# Altium schematic sheet 1_AC-DC&PFC_Driver.schdoc
size 297 x 209 mm; Symbol: sucaimuban; Company: 嘉立创EDA; Version: V1.0; Page Size: A4; @Project Name: 26gsSucaiku; @Update Date: 2026-06-27; @Create Date: 2026-06-21; Device: sucaimuban; @Board Name: Sucaiku; @Page Name: AC-DC&PFC_Driver; @Create Time: 21:33:02; @Page Count: 7; @Page No: 1; @Schematic Name: Schematic1; @Update Time: 20:35:27; @Assembly Variant: Basic; Border: 1; Title Block Position: 3; Size: A4; Width: 1170; Height: 825; Region Start: 1; X Region Count: 6; Y Region Count: 4; Blade Width: 10
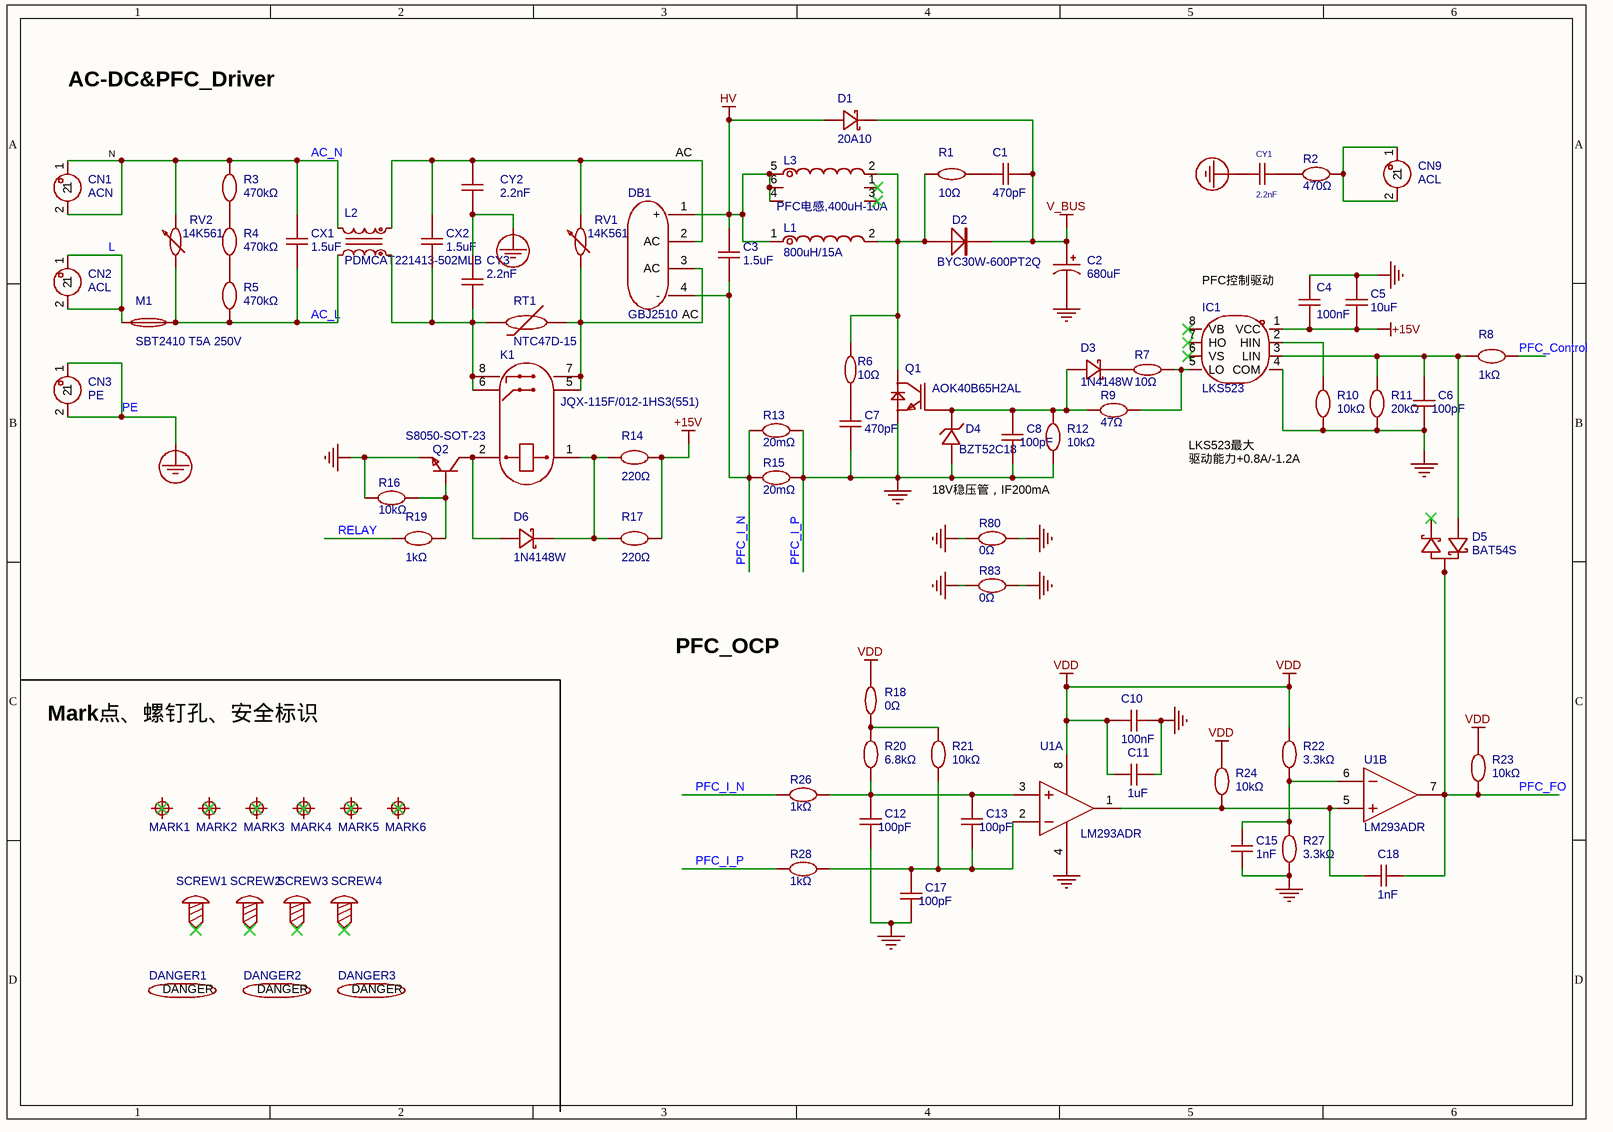
[diagram p0: 1_AC-DC&PFC_Driver.schdoc]

## Parts
C1  470pF  [CAP-TH_L10.0-W4.0-P7.50-D0.6]
C2  680uF  [CAP-TH_BD35.0-P10.00-D2.3-FD]
C3  1.5uF  [CBB 20*16*8.5]
C4  100nF  [C0603]
C5  10uF  [C0805]
C6  100pF  [C0603]
C7  470pF  [CAP-TH_L10.0-W4.0-P7.50-D0.6]
C8  100pF  [C0603]
C10  100nF  [C0603]
C11  1uF  [C0603]
C12  100pF  [C0603]
C13  100pF  [C0603]
C15  1nF  [C0603]
C17  100pF  [C0603]
C18  1nF  [C0603]
CN1  ACN  [CONN-TH_L6.3-W0.8-EST026]
CN2  ACL  [CONN-TH_L6.3-W0.8-EST026]
CN3  PE  [CONN-TH_L6.3-W0.8-EST026]
CN9  ACL  [CONN-TH_L6.3-W0.8-EST026]
CX1  1.5uF  [CAP-TH_L18.0-W11.0-P15.00-D0.8]
CX2  1.5uF  [CAP-TH_L18.0-W11.0-P15.00-D0.8]
CY1  2.2nF  [CAP-TH_L7.0-W3.5-P7.50-D0.6-S2.90]
CY2  2.2nF  [CAP-TH_L6.5-W3.5-P7.50-D1.0]
CY3  2.2nF  [CAP-TH_L6.5-W3.5-P7.50-D1.0]
D1  20A10  [R-6_BD8.9-L8.9-P12.90-D1.3-FD]
D2  BYC30W-600PT2Q  [TO247B - 2pin]
D3  1N4148W  [SOD-123_L2.7-W1.6-LS3.7-FD]
D4  BZT52C18  [SOD-123_L2.8-W1.8-LS3.7-RD]
D5  BAT54S  [SOT-23-3_L2.9-W1.3-P1.90-LS2.4-BR]
D6  1N4148W  [SOD-123_L2.7-W1.6-LS3.7-FD]
DANGER1  (no value)  [DANGER CAUTION_1]
DANGER2  (no value)  [DANGER CAUTION_1]
DANGER3  (no value)  [DANGER CAUTION_1]
DB1  GBJ2510  [DIO-BG-TH_PB]
IC1  LKS523  [SOP-8_L4.9-W3.9-P1.27-LS6.0-BL]
K1  JQX-115F/012-1HS3(551)  [RELAY-TH_JQX-115F-XXX-1H-X-3]
L1  800uH/15A  [L/56*30-V-50*30(25mm)]
L2  PDMCAT221413-502MLB  [IND-TH_4P-L28.0-W18.5_C2924777]
L3  PFC电感,400uH-10A  [L/50*36-V-21*11(7.5)]
M1  SBT2410 T5A 250V  [FUSE-SMD_L6.0-W2.6]
MARK1  (no value)  [Mark-Point-1mm]
MARK2  (no value)  [Mark-Point-1mm]
MARK3  (no value)  [Mark-Point-1mm]
MARK4  (no value)  [Mark-Point-1mm]
MARK5  (no value)  [Mark-Point-1mm]
MARK6  (no value)  [Mark-Point-1mm]
Q1  AOK40B65H2AL  [TO-247-3_L15.8-W5.0-P5.44-L]
Q2  S8050-SOT-23  [SOT-23-3_L2.9-W1.3-P1.90-LS2.5-BR]
R1  10Ω  [R2512]
R2  470Ω  [RES-TH_BD5.6-L10.3-P14.30-D1.0]
R3  470kΩ  [R1206]
R4  470kΩ  [R1206]
R5  470kΩ  [R1206]
R6  10Ω  [R2512]
R7  10Ω  [R0805]
R8  1kΩ  [R0603]
R9  47Ω  [R1206]
R10  10kΩ  [R0603]
R11  20kΩ  [R0603]
R12  10kΩ  [R0603]
R13  20mΩ  [RES-SMD_L6.4-W3.2_LR2512D-3W-1MR]
R14  220Ω  [R1206]
R15  20mΩ  [RES-SMD_L6.4-W3.2_LR2512D-3W-1MR]
R16  10kΩ  [R0603]
R17  220Ω  [R1206]
R18  0Ω  [R0603]
R19  1kΩ  [R0603]
R20  6.8kΩ  [R0603]
R21  10kΩ  [R0603]
R22  3.3kΩ  [R0603]
R23  10kΩ  [R0603]
R24  10kΩ  [R0603]
R26  1kΩ  [R0603]
R27  3.3kΩ  [R0603]
R28  1kΩ  [R0603]
R80  0Ω  [R1206]
R83  0Ω  [R1206]
RT1  NTC47D-15  [NTC-7.5-11]
RV1  14K561  [RES-TH_L16.5-W6.4-P7.50-D0.9-S6.40]
RV2  14K561  [RES-TH_L16.5-W6.4-P7.50-D0.9-S6.40]
SCREW1  (no value)  [M3螺丝]
SCREW2  (no value)  [M3螺丝]
SCREW3  (no value)  [M3螺丝]
SCREW4  (no value)  [M3螺丝]
U1  LM293ADR  [SOIC-8_L4.9-W3.9-P1.27-LS6.2-BL]  (parts A,B of 2)

## Nets
+15V: C4.1 C5.1 IC1.1(VCC) R14.2 R17.2
HV: C3.2 D1.1(A) DB1.1(+) L1.1 L3.4 L3.5 L3.6
PE: CN3.1 CN3.2 CY1.1 CY2.1 CY3.1
PFC_I_P: C2.2 C4.2 C5.2 C6.1 C7.1 C8.1 C10.1 C11.2 C12.1 C15.1 C17.1 D4.2(A) IC1.4(COM) Q1.3(E) Q2.2(E) R10.1 R11.1 R12.1 R13.2 R15.2 R16.2 R27.1 R28.2 R80.1 R80.2 R83.1 R83.2 U1.4(V+)  [also labelled GND]
V_BUS: C1.2 C2.1 D1.2(K) D2.1(K)
VDD: C10.2 C11.1 R18.2 R22.2 R23.2 R24.2 U1.8(GND)
AC_L: CX1.1 L2.2 M1.2 R5.1 RV2.1
AC_N: CN1.1 CN1.2 CX1.2 L2.3 R3.2 RV2.2
L: CN2.1 CN2.2 M1.1
PFC_Control: R8.2
PFC_FO: C18.2 D5.3 R23.1 U1.7(OUT2)
PFC_I_N: C3.1 DB1.4(-) R13.1 R15.1 R26.2
RELAY: R19.1
NetC1_1: C1.1 R1.2
NetC6_2: C6.2 D5.1(A) IC1.3(LIN) R8.1 R11.2
NetC7_2: C7.2 R6.1
NetC8_2: C8.2 D3.1(A) D4.1(C) Q1.1(G) R9.1 R12.2
NetC12_2: C12.2 C13.2 R20.1 R26.1 U1.3(IN1+)
NetC13_1: C13.1 C17.2 R21.1 R28.1 U1.2(IN1-)
NetC15_2: C15.2 R22.1 R27.2 U1.6(IN2-)
NetC18_1: C18.1 R24.1 U1.1(OUT1) U1.5(IN2+)
NetCN9_1: CN9.1 CN9.2 R2.2
NetCX2_1: CX2.1 CY3.2 K1.6 K1.8 L2.1 RT1.1
NetCX2_2: CX2.2 CY2.2 DB1.2(AC) L2.4 RV1.2
NetCY1_2: CY1.2 R2.1
NetD2_2: D2.2(A) L1.2 L3.2 Q1.2(C) R1.1 R6.2
NetD3_2: D3.2(K) R7.1
NetD6_1: D6.1(A) K1.2 Q2.3(C)
NetD6_2: D6.2(K) K1.1 R14.1 R17.1
NetDB1_3: DB1.3(AC) K1.5 K1.7 RT1.2 RV1.1
NetIC1_2: IC1.2(HIN) R10.2
NetIC1_5: IC1.5(LO) R7.2 R9.2
NetQ2_1: Q2.1(B) R16.1 R19.2
NetR3_1: R3.1 R4.2
NetR4_1: R4.1 R5.2
NetR18_1: R18.1 R20.2 R21.2

Not connected (* = marked no-connect by the designer): D5 2(K)*; IC1 6(VS)* 7(HO)* 8(VB)*; L3 1(6)* 3*; MARK1 1*; MARK2 1*; MARK3 1*; MARK4 1*; MARK5 1*; MARK6 1*; SCREW1 1*; SCREW2 1*; SCREW3 1*; SCREW4 1*

## Notes on the sheet
- AC-DC&PFC_Driver
- (near CN1) N
- AC
- (near DB1) AC
- (near IC1) PFC控制驱动
- 18V稳压管，IF200mA
- (near R10) LKS523最大
  驱动能力+0.8A/-1.2A
- PFC_OCP
- Mark点、螺钉孔、安全标识
- 身份证号
- 选手姓名
- 手 机 号
- 图页名称
- 第                      幅
- 工程名称
- 共                    幅
- 当前日期
- 当前时间

## Library data of the parts
C1 = MMKP471K3A0701: 容值:470pF;精度:±10%;额定电压:1kV;工作温度:-40℃~+105℃;; Manufacturer: KYET(科雅); AddInBom: yes; ModelId: 99f403e9d14b42e0ad59132bb97445e0聨0819f05c4eef4c71ace90d822a990e87; ModelName: CAP-TH_BD10.0-W4.0-P7.5; ModelTransform: 392.81,165.20329,0,0,0,0,0,0,-137.795; Tolerance: ±10%; Voltage Rating: 1kV; Symbol: MMKP471K3A0701; Device: MMKP471K3A0701; LCSC Part Name: 470pF ±10% 1kV; SupplierPart: C3019027; ManufacturerPart: MMKP471K3A0701; Supplier Footprint: 插件,P=7.5mm; JLCPCB Part Class: Extended Part; Datasheet: https://item.szlcsc.com/datasheet/MMKP471K3A0701/3533992.html; Supplier: LCSC; ConvertToPcb: yes; FootprintName: CAP-TH_L10.0-W4.0-P7.50-D0.6; Value: 470pF; Operating Temperature: -40℃~+105℃
C2 = KN681M45035*50A: 容值:680uF;精度:±20%;额定电压:450V;脚间距:10mm;等效串联电阻(ESR):-;纹波电流:2.85A@120Hz;; Manufacturer: KFSON(康富松); AddInBom: yes; ModelId: 99655738f73e4d50bff5807320ca27b0聨0819f05c4eef4c71ace90d822a990e87; ModelTransform: 1378.344,1377.53398,0,0,0,0,0,0,-157.48; Tolerance: ±20%; Voltage Rating: 450V; Pin Spacing: 10mm; Lifetime: 2000hrs@105℃; Symbol: KN681M45035*50A; Device: KN681M45035*50A; LCSC Part Name: 680uF ±20% 450V; SupplierPart: C2684457; ManufacturerPart: KN681M45035*50A; Supplier Footprint: 插件,D35xL50mm; JLCPCB Part Class: Extended Part; Datasheet: https://item.szlcsc.com/datasheet/KN681M45035*50A/2782461.html; Supplier: LCSC; ConvertToPcb: yes; FootprintName: CAP-TH_BD35.0-P10.00-D2.3-FD; ModelName: CAP-TH_BD35.0-P10.00-D2.3-FD; Value: 680uF; Equivalent Series Resistance(ESR): -; Ripple Current: 2.85A@120Hz; Diameter: 35mm; Height - Seated (Max): 50mm; Operating Temperature: -25℃~+105℃
C3 = KP155J2J2001: 容值:1.5uF;精度:±5%;额定电压:630V;工作温度:-40℃~+100℃;; Manufacturer: KYET(科雅); AddInBom: yes; ModelId: 8da85e7d984543eb9369ef1ce3ef33f5聨0819f05c4eef4c71ace90d822a990e87; ModelName: CAP-TH_L22.0-W11.0-P20.00-D0.7; ModelTransform: 866.14,433.464,0,0,0,0,0,0,-177.165; Tolerance: ±5%; Voltage Rating: 630V; Symbol: KP155J2J2001; Device: KP155J2J2001; LCSC Part Name: 1.5uF ±5% 630V; SupplierPart: C3019082; ManufacturerPart: KP155J2J2001; Supplier Footprint: 插件,P=20mm; JLCPCB Part Class: Extended Part; Datasheet: https://item.szlcsc.com/datasheet/KP155J2J2001/3534047.html; Supplier: LCSC; ConvertToPcb: yes; FootprintName: CBB 20*16*8.5; Value: 1.5uF; Operating Temperature: -40℃~+100℃
C4 C10 = CL10B104KB8NNNC: 容值:100nF;精度:±10%;额定电压:50V;温度系数:X7R;; Manufacturer: SAMSUNG(三星); AddInBom: yes; ModelId: ac125912035d415993ca9572d50418b1聨0819f05c4eef4c71ace90d822a990e87; ModelName: C0603_L1.6-W0.8-H0.8; ModelTransform: 62.992,31.496,0,0,0,0,0,0,0; Tolerance: ±10%; Voltage Rating: 50V; Temperature Coefficient: X7R; Symbol: CL10B104KB8NNNC; Device: CL10B104KB8NNNC; LCSC Part Name: 100nF ±10% 50V; SupplierPart: C1591; ManufacturerPart: CL10B104KB8NNNC; Supplier Footprint: 0603; JLCPCB Part Class: Extended Part; Datasheet: https://item.szlcsc.com/datasheet/CL10B104KB8NNNC/1943.html; Supplier: LCSC; ConvertToPcb: yes; FootprintName: C0603; Value: 100nF
C5 = CL21A106KAYNNNE_C15850: 容值:10uF;精度:±10%;额定电压:25V;温度系数:X5R;; Manufacturer: SAMSUNG(三星); AddInBom: yes; ModelId: 1ba041120af144c991958decab20d241聨0819f05c4eef4c71ace90d822a990e87; ModelName: C0805_L2.0-W1.3-H1.3; ModelTransform: 78.74,51.181,0,0,0,0,0,0.0005,0; Tolerance: ±10%; Voltage Rating: 25V; Temperature Coefficient: X5R; Symbol: CL21A106KAYNNNE; Device: CL21A106KAYNNNE_C15850; LCSC Part Name: 10uF ±10% 25V; SupplierPart: C15850; ManufacturerPart: CL21A106KAYNNNE; Supplier Footprint: 0805; JLCPCB Part Class: Basic Part; Datasheet: https://item.szlcsc.com/datasheet/CL21A106KAYNNNE/16532.html; Supplier: LCSC; ConvertToPcb: yes; FootprintName: C0805; Value: 10uF
C6 C8 C12 C13 C17 = CC0603JRNPO9BN101: 容值:100pF;精度:±5%;额定电压:50V;温度系数:NP0;; Manufacturer: YAGEO(国巨); AddInBom: yes; ModelId: ac125912035d415993ca9572d50418b1聨0819f05c4eef4c71ace90d822a990e87; ModelName: C0603_L1.6-W0.8-H0.8; ModelTransform: 62.992,31.496,0,0,0,0,0,0,0; Tolerance: ±5%; Voltage Rating: 50V; Temperature Coefficient: NP0; Symbol: CC0603JRNPO9BN101; Device: CC0603JRNPO9BN101; LCSC Part Name: 100pF ±5% 50V; SupplierPart: C14665; ManufacturerPart: CC0603JRNPO9BN101; Supplier Footprint: 0603; JLCPCB Part Class: Extended Part; Datasheet: https://item.szlcsc.com/datasheet/CC0603JRNPO9BN101/15333.html; Supplier: LCSC; ConvertToPcb: yes; FootprintName: C0603; Value: 100pF
C7 = MMKP471K3A0701: 容值:470pF;精度:±10%;额定电压:1kV;工作温度:-40℃~+105℃;; Manufacturer: KYET(科雅); 3D Model: 99f403e9d14b42e0ad59132bb97445e0聨0819f05c4eef4c71ace90d822a990e87; 3D Model Transform: 392.81,165.20329,0,0,0,0,0,0,-137.795; Tolerance: ±10%; Voltage Rating: 1kV; AddInBom: yes; ModelName: CAP-TH_BD10.0-W4.0-P7.5; Symbol: MMKP471K3A0701; Device: MMKP471K3A0701; LCSC Part Name: 470pF ±10% 1kV; Supplier Part: C3019027; Manufacturer Part: MMKP471K3A0701; Supplier Footprint: 插件,P=7.5mm; JLCPCB Part Class: Extended Part; Datasheet: https://item.szlcsc.com/datasheet/MMKP471K3A0701/3533992.html; Supplier: LCSC; Value: 470pF; Operating Temperature: -40℃~+105℃; ConvertToPcb: yes; FootprintName: CAP-TH_L10.0-W4.0-P7.50-D0.6
C11 = CL10B105KA8NNNC: 容值:1uF;精度:±10%;额定电压:25V;温度系数:X7R;; Manufacturer: SAMSUNG(三星); AddInBom: yes; ModelId: ac125912035d415993ca9572d50418b1聨0819f05c4eef4c71ace90d822a990e87; ModelName: C0603_L1.6-W0.8-H0.8; ModelTransform: 62.992,31.496,0,0,0,0,0,0,0; Tolerance: ±10%; Voltage Rating: 25V; Temperature Coefficient: X7R; Symbol: CL10B105KA8NNNC; Device: CL10B105KA8NNNC; LCSC Part Name: 1uF ±10% 25V; SupplierPart: C29936; ManufacturerPart: CL10B105KA8NNNC; Supplier Footprint: 0603; JLCPCB Part Class: Extended Part; Datasheet: https://item.szlcsc.com/datasheet/CL10B105KA8NNNC/30690.html; Supplier: LCSC; ConvertToPcb: yes; FootprintName: C0603; Value: 1uF
C15 C18 = CL10B102KB8NNNC: 容值:1nF;精度:±10%;额定电压:50V;温度系数:X7R;; Manufacturer: SAMSUNG(三星); AddInBom: yes; ModelId: ac125912035d415993ca9572d50418b1聨0819f05c4eef4c71ace90d822a990e87; ModelName: C0603_L1.6-W0.8-H0.8; ModelTransform: 62.992,31.496,0,0,0,0,0,0,0; Tolerance: ±10%; Voltage Rating: 50V; Temperature Coefficient: X7R; Symbol: CL10B102KB8NNNC; Device: CL10B102KB8NNNC; LCSC Part Name: 1nF ±10% 50V; SupplierPart: C1588; ManufacturerPart: CL10B102KB8NNNC; Supplier Footprint: 0603; JLCPCB Part Class: Basic Part; Datasheet: https://item.szlcsc.com/datasheet/CL10B102KB8NNNC/1940.html; Supplier: LCSC; ConvertToPcb: yes; FootprintName: C0603; Value: 1nF
CN1-CN3 = EST026: 环保; Manufacturer: xcfuse(旭程); AddInBom: yes; ModelId: caeb915258b34f389ee2048176497ca2聨0819f05c4eef4c71ace90d822a990e87; ModelTransform: 328.7395,78.74,0,0,0,0,0,0,-137.795; Symbol: EST026; Device: EST026; LCSC Part Name: EST026; SupplierPart: C52878; Supplier Footprint: 插件; Datasheet: https://item.szlcsc.com/datasheet/EST026/53893.html; Supplier: LCSC; ConvertToPcb: yes; FootprintName: CONN-TH_L6.3-W0.8-EST026; ModelName: CONN-TH_L6.3-W0.8-EST026
  CN1: Manufacturer Part: ACN
  CN2: Manufacturer Part: ACL
  CN3: Manufacturer Part: PE
CN9 = EST026: 环保; Manufacturer: xcfuse(旭程); 3D Model: caeb915258b34f389ee2048176497ca2聨0819f05c4eef4c71ace90d822a990e87; 3D Model Transform: 328.7395,78.74,0,0,0,0,0,0,-137.795; AddInBom: yes; Symbol: EST026; Device: EST026; Manufacturer Part: ACL; LCSC Part Name: EST026; Supplier Part: C52878; Supplier Footprint: 插件; JLCPCB Part Class: Extended Part; Datasheet: https://item.szlcsc.com/datasheet/EST026/53893.html; Supplier: LCSC; ConvertToPcb: yes; FootprintName: CONN-TH_L6.3-W0.8-EST026; ModelName: CONN-TH_L6.3-W0.8-EST026
CX1 CX2 = MPX155K31D7KN15800: 容值:1.5uF;精度:±10%;工作电压(AC):275V；310V；305V;防护等级:X2;; Manufacturer: KNSCHA(科尼盛); AddInBom: yes; ModelId: 67037bbaf53542ae96805cc30c99990b聨0819f05c4eef4c71ace90d822a990e87; ModelName: CAP-TH_L18.0-W11.0-H19.0-P15.0; ModelTransform: 708.66,433.07,0,0,0,0,0,0,-137.795; Tolerance: ±10%; Ratings: X2; safety certification: UL；CUL；KC；ENEC；VDE；CQC; Symbol: MPX155K31D7KN15800; Device: MPX155K31D7KN15800; LCSC Part Name: 1.5uF ±10% 275V 305V 310V 等级:X2; SupplierPart: C504227; ManufacturerPart: MPX155K31D7KN15800; Supplier Footprint: 插件,P=15mm; JLCPCB Part Class: Extended Part; Datasheet: https://item.szlcsc.com/datasheet/MPX155K31D7KN15800/516886.html; Supplier: LCSC; ConvertToPcb: yes; FootprintName: CAP-TH_L18.0-W11.0-P15.00-D0.8; Value: 1.5uF; Voltage(AC): 275V；310V；305V; Operating Temperature: -40℃~+110℃
CY1 = JW222M300VACP7.5: 容值:2.2nF;精度:±20%;工作电压(AC):300V;防护等级:Y2;; Manufacturer: JURCC(捷威电子); AddInBom: yes; ModelId: 95618c792d4044faae105d193811dc66聨0819f05c4eef4c71ace90d822a990e87; ModelTransform: 334.645,137.795,0,0,0,0,-0.002,0,-196.85; Tolerance: ±20%; Voltage(AC): 300V; Ratings: Y2; safety certification: UL；ENEC；VDE；CQC; Symbol: JW222M300VACP7.5; Device: JW222M300VACP7.5; LCSC Part Name: 2.2nF ±20% 300V 等级:Y2; SupplierPart: C48997971; ManufacturerPart: JW222M300VACP7.5; Supplier Footprint: 插件,P=7.5mm; JLCPCB Part Class: Extended Part; Datasheet: https://item.szlcsc.com/datasheet/JW222M300VACP7.5/51342107.html; Supplier: LCSC; ConvertToPcb: yes; FootprintName: CAP-TH_L7.0-W3.5-P7.50-D0.6-S2.90; ModelName: CAP-TH_L7.0-W3.5-P7.50-D0.6-S2.90; Value: 2.2nF; Operating Temperature: -25℃~+125℃
CY2 CY3 = KJKF222M2FF7035A075E: 容值:2.2nF;精度:±20%;工作电压(AC):300V;防护等级:Y2;; Manufacturer: KNSCHA(科尼盛); AddInBom: yes; ModelId: a1695fc487ef4c5abbd7ddf84a04b120聨0819f05c4eef4c71ace90d822a990e87; ModelName: CAP-TH_BD6.5-W3.5-P7.5; ModelTransform: 321.76377,145.669,0,0,0,0,-0.005,0,-137.795; Tolerance: ±20%; Voltage(AC): 300V; Ratings: Y2; safety certification: UL；ENEC；VDE；CQC; Symbol: KJKF222M2FF7035A075E; Device: KJKF222M2FF7035A075E; LCSC Part Name: 等级:Y2 2200pF ±20% 300V; SupplierPart: C2803195; ManufacturerPart: KJKF222M2FF7035A075E; Supplier Footprint: 插件,P=7.5mm; JLCPCB Part Class: Extended Part; Datasheet: https://item.szlcsc.com/datasheet/KJKF222M2FF7035A075E/2945566.html; Supplier: LCSC; ConvertToPcb: yes; FootprintName: CAP-TH_L6.5-W3.5-P7.50-D1.0; Value: 2.2nF
D1 = 20A10: 二极管配置:1个独立式;正向压降(Vf):1.1V;直流反向耐压(Vr):1kV;整流电流:20A;; Manufacturer: XCH(旭昌辉); AddInBom: yes; ModelId: 44ca3a3bb809421495e4ca0e88ba9e22聨0819f05c4eef4c71ace90d822a990e87; ModelTransform: 559.054,348.4245,0,0,0,0,0,0,-196.85; Diode Configuration: 1个独立式; Voltage - Forward(Vf@If): 1.1V; Voltage - DC Reverse(Vr): 1kV; Current - Rectified: 20A; Reverse Leakage Current (Ir): 5uA; Non-Repetitive Peak Forward Surge Current: 500A; Operating Junction Temperature Range: -55℃~+150℃; Symbol: 20A10; Device: 20A10; LCSC Part Name: 1kV 20A; SupplierPart: C5280530; ManufacturerPart: 20A10; Supplier Footprint: R-6; JLCPCB Part Class: Extended Part; Datasheet: https://item.szlcsc.com/datasheet/20A10/6016569.html; Supplier: LCSC; ConvertToPcb: yes; FootprintName: R-6_BD8.9-L8.9-P12.90-D1.3-FD; ModelName: R-6_BD8.9-L8.9-P12.90-D1.3-FD
D2 = 二极管\BYC30W-600PT2Q: SAP: 254259000038; AddInBom: yes; Symbol: 二极管\BYC30W-600PT2Q; Device: 二极管\BYC30W-600PT2Q; FootprintName: TO247B - 2pin; OriginFootprint: TO247B - 2pin
D3 = 1N4148W_C7420318: 二极管配置:独立式;整流电流:150mA;直流反向耐压(Vr):100V;正向压降(Vf):1.25V@150mA;反向恢复时间(Trr):4ns;; Manufacturer: R+O(宏嘉诚); 3D Model: 5054d9b7be8b429dad093a54b517b4dd聨0819f05c4eef4c71ace90d822a990e87; 3D Model Transform: 145.669,61.024,0,0,0,0,0,0,0; Diode Configuration: 独立式; Pd - Power Dissipation: 400mW; Current - Rectified: 150mA; Voltage - DC Reverse(Vr): 100V; Non-Repetitive Peak Forward Surge Current: 2A; Reverse Leakage Current (Ir): 1uA@75V; Reverse Recovery Time (trr): 4ns; Operating Junction Temperature Range: -55℃~+150℃; AddInBom: yes; Symbol: 1N4148W_C7420318; Device: 1N4148W_C7420318; LCSC Part Name: 100V 150mA; Supplier Part: C7420318; Manufacturer Part: 1N4148W; Supplier Footprint: SOD-123; JLCPCB Part Class: Extended Part; Datasheet: https://item.szlcsc.com/datasheet/1N4148W/8397140.html; Supplier: LCSC; Voltage - Forward(Vf@If): 1.25V@150mA; ConvertToPcb: yes; FootprintName: SOD-123_L2.7-W1.6-LS3.7-FD; ModelName: SOD-123_L2.7-W1.6-LS3.7-FD
D4 = BZT52C18_C43490: 二极管配置:1个独立式;稳压值(标称值):18V;稳压值(范围):16.8V~19.1V;耗散功率(Pd):500mW;; Manufacturer: CJ(江苏长电/长晶); AddInBom: yes; ModelId: 7884390a25fb4c08947731ebfba7e3f8聨0819f05c4eef4c71ace90d822a990e87; ModelTransform: 144.8816,62.992,0,0,0,0,0,0,0; Diode Configuration: 1个独立式; Zener Voltage(Nom): 18V; Reverse Leakage Current (Ir): 100nA@12.6V; Pd - Power Dissipation: 500mW; Impedance(Zzt): 45Ω; Impedance(Zzk): 225Ω; Operating Junction Temperature Range: -55℃~+150℃; Symbol: BZT52C18; Device: BZT52C18_C43490; LCSC Part Name: 独立式 耐压:18V 电流:0.1uA@12.6V; SupplierPart: C43490; ManufacturerPart: BZT52C18; Supplier Footprint: SOD-123; JLCPCB Part Class: Extended Part; Datasheet: https://item.szlcsc.com/datasheet/BZT52C18/44481.html; Supplier: LCSC; ConvertToPcb: yes; FootprintName: SOD-123_L2.8-W1.8-LS3.7-RD; ModelName: SOD-123_L2.8-W1.8-LS3.7-RD; Zener Voltage(Range): 16.8V~19.1V; Tolerance: -
D5 = BAT54S_C916425: 二极管配置:1对串联式;正向压降(Vf):800mV@100mA;直流反向耐压(Vr):30V;整流电流:200mA;; Manufacturer: JSMSEMI(杰盛微); AddInBom: yes; ModelId: c62791f0466c4ae2a892c056b845b0ca聨0819f05c4eef4c71ace90d822a990e87; ModelName: SOT-23-3P_L2.9-W1.3-H1.0-LS2.4-P0.95; ModelTransform: 98.425,114.173,0,180,0,0,0.0005,-0.0005,0; Diode Configuration: 1对串联式; Voltage - DC Reverse(Vr): 30V; Current - Rectified: 200mA; Reverse Leakage Current (Ir): 2uA@25V; Non-Repetitive Peak Forward Surge Current: 600mA; Symbol: BAT54S_C916425; Device: BAT54S_C916425; LCSC Part Name: 电压:30V 电流:200mA; SupplierPart: C916425; ManufacturerPart: BAT54S; Supplier Footprint: SOT-23; JLCPCB Part Class: Extended Part; Datasheet: https://item.szlcsc.com/datasheet/BAT54S/990921.html; Supplier: LCSC; ConvertToPcb: yes; FootprintName: SOT-23-3_L2.9-W1.3-P1.90-LS2.4-BR; Voltage - Forward(Vf@If): 800mV@100mA
D6 = 1N4148W_C7420318: 二极管配置:独立式;整流电流:150mA;直流反向耐压(Vr):100V;正向压降(Vf):1.25V@150mA;反向恢复时间(Trr):4ns;; Manufacturer: R+O(宏嘉诚); AddInBom: yes; ModelId: 5054d9b7be8b429dad093a54b517b4dd聨0819f05c4eef4c71ace90d822a990e87; ModelTransform: 145.669,61.024,0,0,0,0,0,0,0; Diode Configuration: 独立式; Pd - Power Dissipation: 400mW; Current - Rectified: 150mA; Voltage - DC Reverse(Vr): 100V; Non-Repetitive Peak Forward Surge Current: 2A; Reverse Leakage Current (Ir): 1uA@75V; Reverse Recovery Time (trr): 4ns; Operating Junction Temperature Range: -55℃~+150℃; Symbol: 1N4148W_C7420318; Device: 1N4148W_C7420318; LCSC Part Name: 100V 150mA; SupplierPart: C7420318; ManufacturerPart: 1N4148W; Supplier Footprint: SOD-123; JLCPCB Part Class: Extended Part; Datasheet: https://item.szlcsc.com/datasheet/1N4148W/8397140.html; Supplier: LCSC; ConvertToPcb: yes; FootprintName: SOD-123_L2.7-W1.6-LS3.7-FD; ModelName: SOD-123_L2.7-W1.6-LS3.7-FD; Voltage - Forward(Vf@If): 1.25V@150mA
DANGER1-DANGER3 = DANGER: AddInBom: yes; Symbol: DANGER; Device: DANGER; FootprintName: DANGER CAUTION_1; ConvertToPcb: yes
DB1 = GBJ2510_C27523: 正向压降(Vf):1V@12.5A;直流反向耐压 (Vr):1kV;整流电流:25A;非重复峰值浪涌电流 (Ifsm):350A;; Manufacturer: MDD(辰达半导体); AddInBom: yes; ModelId: 7b3dffbc1a98477fa7ce54e971affac0聨0819f05c4eef4c71ace90d822a990e87; ModelName: DIO-BG-TH_GBJ-L30.0-W4.6-H20.0; ModelTransform: 1181.1,181.102,0,0,0,0,0,23.622,-137.795; Voltage - DC Reverse(Vr): 1kV; Current - Rectified: 25A; Reverse Leakage Current (Ir): 10uA@1kV; Non-Repetitive Peak Forward Surge Current: 350A; Operating Junction Temperature Range: -55℃~+150℃@(Tj); Symbol: GBJ2510; Device: GBJ2510_C27523; LCSC Part Name: 耐压:1000V 电流:25A; SupplierPart: C27523; ManufacturerPart: GBJ2510; Supplier Footprint: GBJ6; JLCPCB Part Class: Extended Part; Datasheet: https://item.szlcsc.com/datasheet/GBJ2510/28272.html; Supplier: LCSC; ConvertToPcb: yes; FootprintName: DIO-BG-TH_PB; Voltage - Forward(Vf@If): 1V@12.5A; Type: 单相整流
IC1 = LKS523: 驱动配置:半桥;负载类型:MOSFET；IGBT;驱动通道数:2;灌电流(IOL):-;拉电流(IOH):-;工作电压:10V~20V;上升时间(tr):160ns;下降时间(tf):40ns;; Manufacturer: LINKOSEMI(凌鸥创芯); AddInBom: yes; ModelId: 75c24a7891ee4dd6bdac16a7163ff87e聨0819f05c4eef4c71ace90d822a990e87; ModelName: SOP-8_L4.9-W3.9-P1.27-LS6.0-BL-1; ModelTransform: 192.913,236.22,0,0,0,0,-0.393,2.749,0; Driven Configuration: 半桥; Number of Drivers: 2; Rise Time: 160ns; Fall Time: 40ns; Propagation Delay tpLH: 250ns; Input Logic Level - High: 2.4V~10V; Quiescent Current(Iq): 50uA; Symbol: LKS523; Device: LKS523; LCSC Part Name: 600V半桥预驱动器; SupplierPart: C6337451; ManufacturerPart: LKS523; Supplier Footprint: SOP-8; JLCPCB Part Class: Extended Part; Datasheet: https://item.szlcsc.com/datasheet/LKS523/7286042.html; Supplier: LCSC; ConvertToPcb: yes; FootprintName: SOP-8_L4.9-W3.9-P1.27-LS6.0-BL; Load Type: MOSFET；IGBT; Current - Output Low(IOL): -; Current - Output High(IOH): -; Voltage - Supply: 10V~20V; Propagation Delay tpHL: -; Features: 欠压保护(UVP); Operating Temperature: -40℃~+150℃; Input Logic Level - Low: -
K1 = JQX-115F/012-1HS3(551): 线圈电压:12V;触点形式:一组常开:1A(单刀单掷-常开);触点容量(电阻负载):16A@250VAC;最大切换电压:440V@AC；125V@DC;最大切换电流:16A;; Manufacturer: HF(宏发); AddInBom: yes; ModelId: 97babde272554f80b5cf5d364714ca22聨0819f05c4eef4c71ace90d822a990e87; ModelTransform: 499.999,1141.73,0,0,0,0,0,-3.937,-157.48; Coil Voltage: 12V; Coil Rated Power: 400mW; Switching Current(Max): 16A; Coil Type: 无极性-单线圈; Coil Resistance: 360Ω; Contact Resistance: 50mΩ; Operate Time: 15ms; Release Time: 8ms; Symbol: JQX-115F/012-1HS3(551); Device: JQX-115F/012-1HS3(551); LCSC Part Name: 12V继电器 单刀单掷-常开; SupplierPart: C2976884; ManufacturerPart: JQX-115F/012-1HS3(551); Supplier Footprint: DIP,29x12.7mm; JLCPCB Part Class: Extended Part; Datasheet: https://item.szlcsc.com/datasheet/JQX-115F%252F012-1HS3(551)/3385104.html; Supplier: LCSC; ConvertToPcb: yes; FootprintName: RELAY-TH_JQX-115F-XXX-1H-X-3; ModelName: RELAY-TH_JQX-115F-XXX-1H-X-3; Contact Form: 一组常开:1A(单刀单掷-常开); Number of Pins: 6; Contact Rating: 16A@250VAC; Switching Voltage(Max): 440V@AC；125V@DC; Contact Material: AgCdO; Operating Temperature: -40℃~+85℃; Length: 29mm; Width: 12.7mm
L1 = PFC电感,NPF184060,H56mm,800uH/15A,DIP: AddInBom: yes; Symbol: PFC电感,NPF184060,H56mm,800uH/15A,DIP; Device: PFC电感,NPF184060,H56mm,800uH/15A,DIP; FootprintName: L/56*30-V-50*30(25mm); OriginFootprint: L/56*30-V-50*30(25mm)
L2 = PDMCAT221413-502MLB: 通道数:2;电感@频率:5mH@1kHz;阻抗@频率:-;直流电阻(DCR):28mΩ;; Manufacturer: PROD(谱罗德); AddInBom: yes; ModelId: a35421b700c54666aff5300c8b8d11b3聨0819f05c4eef4c71ace90d822a990e87; ModelTransform: 1101.94449,728.345,0,0,0,0,0,0,-118.11; Number of Lines: 2; Current Rating: 9.5A; Voltage Rating - DC: 1.5kV; DC Resistance(DCR): 28mΩ; Symbol: PDMCAT221413-502MLB; Device: PDMCAT221413-502MLB; LCSC Part Name: 两路 插件共模滤波器; SupplierPart: C2924779; ManufacturerPart: PDMCAT221413-502MLB; Supplier Footprint: 插件-4P,28x18.5mm; JLCPCB Part Class: Extended Part; Datasheet: https://item.szlcsc.com/datasheet/PDMCAT221413-502MLB/3242508.html; Supplier: LCSC; ConvertToPcb: yes; FootprintName: IND-TH_4P-L28.0-W18.5_C2924777; ModelName: IND-TH_4P-L28.0-W18.5_C2924777; Inductance @ Frequency: 5mH@1kHz; Impedance @ Frequency: -; Voltage Rating (AC): 1.5kV; Voltage Withstand: 1.5kV; Operating Temperature: -25℃~+105℃; Insulation Resistance(IR): -
L3 = 400uH-10A L21 W11: AddInBom: yes; Symbol: 400uH-10A L21 W11; Device: 400uH-10A L21 W11; FootprintName: L/50*36-V-21*11(7.5); OriginFootprint: L/50*36-V-21*11(7.5); ConvertToPcb: yes
M1 = SBT2410 T5A 250V: Manufacturer: CHEVRON(诚润电子); AddInBom: yes; ModelId: f316ebb9f9ad4eff889fde0d73b65136聨0819f05c4eef4c71ace90d822a990e87; ModelTransform: 236.22,102.362,0,0,0,0,0,0,0; Symbol: SBT2410 T5A 250V; Device: SBT2410 T5A 250V; LCSC Part Name: 5A 250V; SupplierPart: C2839753; ManufacturerPart: SBT2410 T5A 250V; Supplier Footprint: SMD; JLCPCB Part Class: Extended Part; Datasheet: https://item.szlcsc.com/datasheet/SBT2410%2520T5A%2520250V/3017024.html; Supplier: LCSC; ConvertToPcb: yes; FootprintName: FUSE-SMD_L6.0-W2.6; ModelName: FUSE-SMD_L6.0-W2.6
MARK1-MARK6 = Mark-Point: Mark点; AddInBom: no; ConvertToPcb: yes; Symbol: Mark-Point; Device: Mark-Point; FootprintName: Mark-Point-1mm
Q1 = AOK40B65H2AL: IGBT类型:-;集射极击穿电压(Vces):650V;集电极电流(Ic):80A;耗散功率(Pd):-;; Manufacturer: AOS; AddInBom: yes; ModelId: 2dc33f6e48bd44aa838c2b9e2b85eb16聨0819f05c4eef4c71ace90d822a990e87; ModelTransform: 622.04631,185.078,0,0,0,0,-0.003,13.778,-196.85; Collector-Emitter Breakdown Voltage (Vces): 650V; Current - Collector(Ic): 80A; Voltage - Forward(Vf): 2.12V@20A; Vce Saturation(VCE(sat)): 2.6V@40A,15V; Gate-Emitter Threshold Voltage (Vge(th)@Ic): 4.7V@1mA; Gate Charge(Qg): 61nC; Input Capacitance(Cies): 1.23nF@25V; Td(on): 30ns; Td(off): 117ns; Turn-On Energy (Eon): 1.17mJ; Switching Energy(Eoff): 540uJ; Reverse Recovery Time(trr): 315ns; Symbol: AOK40B65H2AL; Device: AOK40B65H2AL; LCSC Part Name: AOK40B65H2AL; SupplierPart: C17588896; ManufacturerPart: AOK40B65H2AL; Supplier Footprint: TO-247; JLCPCB Part Class: Extended Part; Datasheet: https://item.szlcsc.com/datasheet/AOK40B65H2AL/18718129.html; Supplier: LCSC; ConvertToPcb: yes; FootprintName: TO-247-3_L15.8-W5.0-P5.44-L; ModelName: TO-247-3_L15.8-W5.0-P5.44-L; IGBT Type: -; Pd - Power Dissipation: -; Operating Temperature: -
Q2 = S8050-SOT-23: 晶体管类型：NPN。                 集电极电流ICM:0.5A                   集电极-基极击穿电压BVCBO:40V         集电极-发射极击穿电压BVCEO:25V       直流电流增益HFE:200-350                        丝印：J3Y; Manufacturer: DDF(鼎德丰); AddInBom: yes; ModelId: 6ea1b42e609b4c388d37f6ca14da8e20聨0819f05c4eef4c71ace90d822a990e87; ModelTransform: 114.173,98.425,0,90,0,0,0.001,-0.001,0; Symbol: S8050-SOT-23; Device: S8050-SOT-23; LCSC Part Name: S8050-SOT-23; SupplierPart: C50229533; ManufacturerPart: S8050-SOT-23; Supplier Footprint: SOT-23; JLCPCB Part Class: Extended Part; Datasheet: https://item.szlcsc.com/datasheet/S8050-SOT-23/52814686.html; Supplier: LCSC; ConvertToPcb: yes; FootprintName: SOT-23-3_L2.9-W1.3-P1.90-LS2.5-BR; ModelName: SOT-23-3_L2.9-W1.3-P1.90-LS2.5-BR
R1 = 25121WF100JT4E: 电阻类型:厚膜电阻;阻值:10Ω;精度:±1%;功率:1W;工作电压:200V;温度系数:±400ppm/℃;; Manufacturer: UNI-ROYAL(厚声); AddInBom: yes; ModelId: 954b67263d9e4f3582d8de3f8c846421聨0819f05c4eef4c71ace90d822a990e87; ModelName: R2512_L6.3-W3.2-H0.6; ModelTransform: 248.031,125.984,0,0,0,0,-0.0005,0,0; Tolerance: ±1%; Power(Watts): 1W; Voltage-Supply(Max): 200V; Symbol: 25121WF100JT4E; Device: 25121WF100JT4E; LCSC Part Name: 10Ω ±1% 1W 厚膜电阻; SupplierPart: C47019; ManufacturerPart: 25121WF100JT4E; Supplier Footprint: 2512; JLCPCB Part Class: Extended Part; Datasheet: https://item.szlcsc.com/datasheet/25121WF100JT4E/48024.html; Supplier: LCSC; ConvertToPcb: yes; FootprintName: R2512; Type: 厚膜电阻; Value: 10Ω; Temperature Coefficient: ±400ppm/℃; Operating Temperature: -55℃~+155℃
R2 = 42J470E: 电阻类型:绕线电阻;阻值:470Ω;精度:±5%;功率:2W;温度系数:±20ppm/℃;; Manufacturer: Ohmite; AddInBom: yes; ModelId: 4747cf4e98b642d29179640c6a2117b8聨0819f05c4eef4c71ace90d822a990e87; ModelTransform: 602.361,220.472,0,0,0,0,0,0,-196.85; Tolerance: ±5%; Power(Watts): 2W; Symbol: 42J470E; Device: 42J470E; LCSC Part Name: 绕线电阻 470Ω ±5% 2W; SupplierPart: C2647050; ManufacturerPart: 42J470E; Supplier Footprint: 插件,D5.6xL10.3mm; JLCPCB Part Class: Extended Part; Datasheet: https://atta.szlcsc.com/upload/public/pdf/source/20210415/FD57F7914712F3BEBDE1F10436F3A07C.pdf; Supplier: LCSC; ConvertToPcb: yes; FootprintName: RES-TH_BD5.6-L10.3-P14.30-D1.0; ModelName: RES-TH_BD5.6-L10.3-P14.30-D1.0; Type: 绕线电阻; Value: 470Ω; Temperature Coefficient: ±20ppm/℃; Operating Temperature Range: -
R3-R5 = FQV1206F4703TS: 电阻类型:厚膜电阻;阻值:470kΩ;精度:±1%;功率:250mW;工作电压:500V;温度系数:±200ppm/℃;; Manufacturer: FOJAN(富捷); AddInBom: yes; ModelId: 89a1f13db2384da588040e0b3c55bf66聨0819f05c4eef4c71ace90d822a990e87; ModelName: R1206_L3.2-W1.6-H0.6; ModelTransform: 125.984,62.992,0,0,0,0,0,0,0; Tolerance: ±1%; Power(Watts): 250mW; Voltage-Supply(Max): 500V; Symbol: FQV1206F4703TS; Device: FQV1206F4703TS; LCSC Part Name: 厚膜电阻 470KΩ ±1% 250mW; SupplierPart: C53064385; ManufacturerPart: FQV1206F4703TS; Supplier Footprint: 1206; JLCPCB Part Class: Extended Part; Datasheet: https://item.szlcsc.com/datasheet/FQV1206F4703TS/56018987.html; Supplier: LCSC; ConvertToPcb: yes; FootprintName: R1206; Type: 厚膜电阻; Value: 470kΩ; Temperature Coefficient: ±200ppm/℃; Operating Temperature: -55℃~+155℃
R6 = 25121WF100JT4E: 电阻类型:厚膜电阻;阻值:10Ω;精度:±1%;功率:1W;工作电压:200V;温度系数:±400ppm/℃;; Manufacturer: UNI-ROYAL(厚声); 3D Model: 954b67263d9e4f3582d8de3f8c846421聨0819f05c4eef4c71ace90d822a990e87; 3D Model Transform: 248.031,125.984,0,0,0,0,-0.0005,0,0; Tolerance: ±1%; Power(Watts): 1W; Voltage-Supply(Max): 200V; AddInBom: yes; ModelName: R2512_L6.3-W3.2-H0.6; Symbol: 25121WF100JT4E; Device: 25121WF100JT4E; LCSC Part Name: 10Ω ±1% 1W 厚膜电阻; Supplier Part: C47019; Manufacturer Part: 25121WF100JT4E; Supplier Footprint: 2512; JLCPCB Part Class: Extended Part; Datasheet: https://item.szlcsc.com/datasheet/25121WF100JT4E/48024.html; Supplier: LCSC; Type: 厚膜电阻; Value: 10Ω; Temperature Coefficient: ±400ppm/℃; Operating Temperature: -55℃~+155℃; ConvertToPcb: yes; FootprintName: R2512
R7 = RC0805JR-0710RL: 电阻类型:厚膜电阻;阻值:10Ω;精度:±5%;功率:125mW;工作电压:150V;温度系数:±200ppm/℃;; Manufacturer: YAGEO(国巨); AddInBom: yes; ModelId: 37a81e68749a4138bd2dfa6897b24b85聨0819f05c4eef4c71ace90d822a990e87; ModelName: R0805_L2.0-W1.3-H0.6; ModelTransform: 78.74,51.181,0,0,0,0,0,-0.0005,0; Tolerance: ±5%; Power(Watts): 125mW; Voltage-Supply(Max): 150V; Symbol: RC0805JR-0710RL; Device: RC0805JR-0710RL; LCSC Part Name: 厚膜电阻 10Ω ±5% 125mW; SupplierPart: C137478; ManufacturerPart: RC0805JR-0710RL; Supplier Footprint: 0805; JLCPCB Part Class: Extended Part; Datasheet: https://item.szlcsc.com/datasheet/RC0805JR-0710RL/148794.html; Supplier: LCSC; ConvertToPcb: yes; FootprintName: R0805; Type: 厚膜电阻; Value: 10Ω; Temperature Coefficient: ±200ppm/℃; Operating Temperature: -55℃~+155℃
R8 R26 R28 = AST031KF: 阻值:1kΩ;精度:±1%;功率:100mW;工作电压:75V;温度系数:±100ppm/℃;; Manufacturer: HKR(香港电阻); 3D Model: fc143cca1e79419f9cd78b61e9279f08聨0819f05c4eef4c71ace90d822a990e87; 3D Model Transform: 31.8897,63.7794,0,90,0,0,0,0,0; Tolerance: ±1%; Power(Watts): 100mW; Voltage-Supply(Max): 75V; AddInBom: yes; Symbol: AST031KF; Device: AST031KF; LCSC Part Name: 1K ±1%; Supplier Part: C49330120; Manufacturer Part: AST031KF; Supplier Footprint: 0603; JLCPCB Part Class: Extended Part; Datasheet: https://item.szlcsc.com/datasheet/AST031KF/51811762.html; Supplier: LCSC; Value: 1kΩ; Temperature Coefficient: ±100ppm/℃; Operating Temperature: -55℃~+155℃; ConvertToPcb: yes; FootprintName: R0603; ModelName: R0603
R9 = FRC1206J470 TS: 电阻类型:厚膜电阻;阻值:47Ω;精度:±5%;功率:250mW;工作电压:200V;温度系数:±100ppm/℃;; Manufacturer: FOJAN(富捷); AddInBom: yes; ModelId: 89a1f13db2384da588040e0b3c55bf66聨0819f05c4eef4c71ace90d822a990e87; ModelName: R1206_L3.2-W1.6-H0.6; ModelTransform: 125.984,62.992,0,0,0,0,0,0,0; Tolerance: ±5%; Power(Watts): 250mW; Voltage-Supply(Max): 200V; Symbol: FRC1206J470 TS; Device: FRC1206J470 TS; LCSC Part Name: 47Ω ±5% 250mW 厚膜电阻; SupplierPart: C2907508; ManufacturerPart: FRC1206J470 TS; Supplier Footprint: 1206; JLCPCB Part Class: Extended Part; Supplier: LCSC; ConvertToPcb: yes; FootprintName: R1206; Type: 厚膜电阻; Value: 47Ω; Temperature Coefficient: ±100ppm/℃; Operating Temperature: -55℃~+155℃
R10 R12 R16 R21 R23 R24 = AST0310KF: 阻值:10kΩ;精度:±1%;功率:100mW;工作电压:75V;温度系数:±100ppm/℃;; Manufacturer: HKR(香港电阻); 3D Model: fc143cca1e79419f9cd78b61e9279f08聨0819f05c4eef4c71ace90d822a990e87; 3D Model Transform: 31.8897,63.7794,0,90,0,0,0,0,0; Tolerance: ±1%; Power(Watts): 100mW; Voltage-Supply(Max): 75V; AddInBom: yes; Symbol: AST0310KF; Device: AST0310KF; LCSC Part Name: 10K ±1%; Supplier Part: C49330116; Manufacturer Part: AST0310KF; Supplier Footprint: 0603; JLCPCB Part Class: Extended Part; Datasheet: https://item.szlcsc.com/datasheet/AST0310KF/51811758.html; Supplier: LCSC; Value: 10kΩ; Temperature Coefficient: ±100ppm/℃; Operating Temperature: -55℃~+155℃; ConvertToPcb: yes; FootprintName: R0603; ModelName: R0603
R11 = AST0320KF: 阻值:20kΩ;精度:±1%;功率:100mW;工作电压:75V;温度系数:±100ppm/℃;; Manufacturer: HKR(香港电阻); AddInBom: yes; ModelId: fc143cca1e79419f9cd78b61e9279f08聨0819f05c4eef4c71ace90d822a990e87; ModelTransform: 31.8897,63.7794,0,90,0,0,0,0,0; Tolerance: ±1%; Power(Watts): 100mW; Voltage-Supply(Max): 75V; Symbol: AST0320KF; Device: AST0320KF; LCSC Part Name: 20K ±1%; SupplierPart: C49330123; ManufacturerPart: AST0320KF; Supplier Footprint: 0603; JLCPCB Part Class: Extended Part; Datasheet: https://item.szlcsc.com/datasheet/AST0320KF/51811765.html; Supplier: LCSC; ConvertToPcb: yes; FootprintName: R0603; ModelName: R0603; Value: 20kΩ; Temperature Coefficient: ±100ppm/℃; Operating Temperature: -55℃~+155℃
R13 R15 = HoYLR2512-3W-20mR-1%: 电阻类型:采样电阻;阻值:20mΩ;精度:±1%;功率:3W;安装方式:贴片;; Manufacturer: Milliohm(毫欧); AddInBom: yes; ModelId: 6cf6cbf2d5784533885afd09834c70e8聨0819f05c4eef4c71ace90d822a990e87; ModelTransform: 252.7554,126.7714,0,0,0,0,0,0,0; Tolerance: ±1%; Power(Watts): 3W; Mounting Sytle: 贴片; Symbol: HOYLR2512-3W-20MR-1%; Device: HoYLR2512-3W-20mR-1%; LCSC Part Name: 20mΩ ±1% 3W; SupplierPart: C5375467; ManufacturerPart: HoYLR2512-3W-20mR-1%; Supplier Footprint: 2512; JLCPCB Part Class: Extended Part; Datasheet: https://atta.szlcsc.com/upload/public/pdf/source/20230410/281FB57F2A31C64FD07DBC5FCC932F0E.pdf; Supplier: LCSC; ConvertToPcb: yes; FootprintName: RES-SMD_L6.4-W3.2_LR2512D-3W-1MR; ModelName: RES-SMD_L6.4-W3.2_LR2512D-3W-1MR; Type: 采样电阻; Value: 20mΩ
R14 R17 = AC1206JR-07220RL: 电阻类型:厚膜电阻;阻值:220Ω;精度:±5%;功率:250mW;工作电压:200V;温度系数:±100ppm/℃;; Manufacturer: YAGEO(国巨); AddInBom: yes; ModelId: 89a1f13db2384da588040e0b3c55bf66聨0819f05c4eef4c71ace90d822a990e87; ModelName: R1206_L3.2-W1.6-H0.6; ModelTransform: 125.984,62.992,0,0,0,0,0,0,0; Tolerance: ±5%; Power(Watts): 250mW; Voltage-Supply(Max): 200V; Symbol: AC1206JR-07220RL; Device: AC1206JR-07220RL; LCSC Part Name: 厚膜电阻 220Ω ±5% 250mW; SupplierPart: C229909; ManufacturerPart: AC1206JR-07220RL; Supplier Footprint: 1206; JLCPCB Part Class: Extended Part; Datasheet: https://item.szlcsc.com/datasheet/AC1206JR-07220RL/229889.html; Supplier: LCSC; ConvertToPcb: yes; FootprintName: R1206; Type: 厚膜电阻; Value: 220Ω; Temperature Coefficient: ±100ppm/℃; Operating Temperature: -55℃~+155℃
R18 = RC0603JR-070RL: 电阻类型:厚膜电阻;阻值:0Ω;精度:±5%;功率:100mW;工作电压:75V;温度系数:-;; Manufacturer: YAGEO(国巨); AddInBom: yes; ModelId: fc143cca1e79419f9cd78b61e9279f08聨0819f05c4eef4c71ace90d822a990e87; ModelTransform: 31.8897,63.7794,0,90,0,0,0,0,0; Tolerance: ±5%; Power(Watts): 100mW; Voltage-Supply(Max): 75V; Symbol: RC0603JR-070RL; Device: RC0603JR-070RL; LCSC Part Name: 厚膜电阻 0Ω ±5% 100mW; SupplierPart: C95177; ManufacturerPart: RC0603JR-070RL; Supplier Footprint: 0603; JLCPCB Part Class: Extended Part; Datasheet: https://item.szlcsc.com/datasheet/RC0603JR-070RL/96378.html; Supplier: LCSC; ConvertToPcb: yes; FootprintName: R0603; ModelName: R0603; Type: 厚膜电阻; Value: 0Ω; Temperature Coefficient: -; Operating Temperature: -55℃~+155℃
R19 = AST031KF: 阻值:1kΩ;精度:±1%;功率:100mW;工作电压:75V;温度系数:±100ppm/℃;; Manufacturer: HKR(香港电阻); AddInBom: yes; ModelId: fc143cca1e79419f9cd78b61e9279f08聨0819f05c4eef4c71ace90d822a990e87; ModelTransform: 31.8897,63.7794,0,90,0,0,0,0,0; Tolerance: ±1%; Power(Watts): 100mW; Voltage-Supply(Max): 75V; Symbol: AST031KF; Device: AST031KF; LCSC Part Name: 1K ±1%; SupplierPart: C49330120; ManufacturerPart: AST031KF; Supplier Footprint: 0603; JLCPCB Part Class: Extended Part; Datasheet: https://item.szlcsc.com/datasheet/AST031KF/51811762.html; Supplier: LCSC; ConvertToPcb: yes; FootprintName: R0603; ModelName: R0603; Value: 1kΩ; Temperature Coefficient: ±100ppm/℃; Operating Temperature: -55℃~+155℃
R20 = FRC0603F6801TS: 电阻类型:厚膜电阻;阻值:6.8kΩ;精度:±1%;功率:100mW;工作电压:75V;温度系数:±100ppm/℃;; Manufacturer: FOJAN(富捷); AddInBom: yes; ModelId: fc143cca1e79419f9cd78b61e9279f08聨0819f05c4eef4c71ace90d822a990e87; ModelTransform: 31.8897,63.7794,0,90,0,0,0,0,0; Tolerance: ±1%; Power(Watts): 100mW; Voltage-Supply(Max): 75V; Symbol: FRC0603F6801TS; Device: FRC0603F6801TS; LCSC Part Name: 6.8kΩ ±1% 100mW 厚膜电阻; SupplierPart: C2907055; ManufacturerPart: FRC0603F6801TS; Supplier Footprint: 0603; JLCPCB Part Class: Extended Part; Supplier: LCSC; ConvertToPcb: yes; FootprintName: R0603; ModelName: R0603; Type: 厚膜电阻; Value: 6.8kΩ; Temperature Coefficient: ±100ppm/℃; Operating Temperature: -55℃~+155℃
R22 R27 = FRC0603F3301TS: 电阻类型:厚膜电阻;阻值:3.3kΩ;精度:±1%;功率:100mW;工作电压:75V;温度系数:±100ppm/℃;; Manufacturer: FOJAN(富捷); AddInBom: yes; ModelId: fc143cca1e79419f9cd78b61e9279f08聨0819f05c4eef4c71ace90d822a990e87; ModelTransform: 31.8897,63.7794,0,90,0,0,0,0,0; Tolerance: ±1%; Power(Watts): 100mW; Voltage-Supply(Max): 75V; Symbol: FRC0603F3301TS; Device: FRC0603F3301TS; LCSC Part Name: 3.3kΩ ±1% 100mW 厚膜电阻; SupplierPart: C2907023; ManufacturerPart: FRC0603F3301TS; Supplier Footprint: 0603; JLCPCB Part Class: Extended Part; Datasheet: https://item.szlcsc.com/datasheet/FRC0603F3301TS/3180536.html; Supplier: LCSC; ConvertToPcb: yes; FootprintName: R0603; ModelName: R0603; Type: 厚膜电阻; Value: 3.3kΩ; Temperature Coefficient: ±100ppm/℃; Operating Temperature: -55℃~+155℃
R80 = FRC1206P000 TS: 电阻类型:厚膜电阻;阻值:0Ω;精度:±5%;功率:250mW;工作电压:200V;; Manufacturer: FOJAN(富捷); AddInBom: yes; ModelId: 89a1f13db2384da588040e0b3c55bf66聨0819f05c4eef4c71ace90d822a990e87; ModelName: R1206_L3.2-W1.6-H0.6; ModelTransform: 125.984,62.992,0,0,0,0,0,0,0; Tolerance: ±5%; Power(Watts): 250mW; Voltage-Supply(Max): 200V; Symbol: FRC1206P000 TS; Device: FRC1206P000 TS; LCSC Part Name: 0Ω ±5% 250mW 厚膜电阻; SupplierPart: C2907406; ManufacturerPart: FRC1206P000 TS; Supplier Footprint: 1206; JLCPCB Part Class: Extended Part; Supplier: LCSC; ConvertToPcb: yes; FootprintName: R1206; Type: 厚膜电阻; Value: 0Ω; Operating Temperature: -55℃~+155℃
R83 = FRC1206P000 TS: 电阻类型:厚膜电阻;阻值:0Ω;精度:±5%;功率:250mW;工作电压:200V;; Manufacturer: FOJAN(富捷); 3D Model: 89a1f13db2384da588040e0b3c55bf66聨0819f05c4eef4c71ace90d822a990e87; 3D Model Transform: 125.984,62.992,0,0,0,0,0,0,0; Tolerance: ±5%; Power(Watts): 250mW; Voltage-Supply(Max): 200V; AddInBom: yes; ModelName: R1206_L3.2-W1.6-H0.6; Symbol: FRC1206P000 TS; Device: FRC1206P000 TS; LCSC Part Name: 0Ω ±5% 250mW 厚膜电阻; Supplier Part: C2907406; Manufacturer Part: FRC1206P000 TS; Supplier Footprint: 1206; JLCPCB Part Class: Extended Part; Supplier: LCSC; Type: 厚膜电阻; Value: 0Ω; Operating Temperature: -55℃~+155℃; ConvertToPcb: yes; FootprintName: R1206
RT1 = NTC47D-15: 阻值:47Ω;B值(25℃/50℃):-;功率:-;B值精度:-;最大稳态电流(25℃):3A;; Manufacturer: RUILON(瑞隆源); Symbol: MF72 47D15; AddInBom: yes; ModelId: 2867f97682bb4e60b655d19a123637de聨0819f05c4eef4c71ace90d822a990e87; ModelName: RES-TH_L16.5-W7.0-H22.5-P7.50-D0.8-S7.0; ModelTransform: 649.47319,307.086,0,0,0,0,0.079,0,-196.85; Resistance @ 25℃: 47Ω; Steady State Current (Max): 3A; Device: NTC47D-15; LCSC Part Name: 47Ω; SupplierPart: C12398; ManufacturerPart: NTC47D-15; Supplier Footprint: 插件,P=7.5mm; JLCPCB Part Class: Extended Part; Datasheet: https://item.szlcsc.com/datasheet/NTC47D-15/13028.html; Supplier: LCSC; ConvertToPcb: yes; FootprintName: NTC-7.5-11; B Constant (25℃/50℃): -; B Constant (25℃/75℃): -; B Constant (25℃/85℃): -; B Constant (25℃/100℃): -; Power(Watts): -; B Constant Tolerance: -; Operating Temperature: -55℃~+200℃
RV1 RV2 = FNR-14K561: 压敏电压:504V~616V;钳位电压:925V;工作电压:455V;工作电压(AC):350V;; Manufacturer: FH(风华); AddInBom: yes; ModelId: 1d82582c2e294565bb4a21e6e6d2374a聨0819f05c4eef4c71ace90d822a990e87; ModelName: RES-TH_L17.5-W6.4-H21.0-P7.50-D0.8-S6.40; ModelTransform: 688.96579,283.464,0,0,0,0,0,0,-157.48; Clamping Voltage: 925V; Maximum DC Volts: 455V; Maximum AC Volts: 350V; Peak Current: 4.5kA; Energy: 104J; Symbol: FNR-14K561; Device: FNR-14K561; Value: 14K561; LCSC Part Name: 钳位电压925V 104焦耳 插件压敏电阻; ManufacturerPart: FNR-14K561; Supplier Footprint: 插件; JLCPCB Part Class: Extended Part; Datasheet: https://atta.szlcsc.com/upload/public/pdf/source/20190509/C390700_613469742418004B73D7E01107A1F380.pdf; Supplier: LCSC; ConvertToPcb: yes; FootprintName: RES-TH_L16.5-W6.4-P7.50-D0.9-S6.40; Varistor Voltage: 504V~616V
SCREW1-SCREW4 = M3螺丝: Symbol: 螺丝孔; ConvertToPcb: yes; Device: M3螺丝; AddInBom: yes; Supplier Footprint: 插件; FootprintName: M3螺丝
U1 = LM293AM/TR: 比较器数:双路;输入失调电压(Vos):1mV;输入偏置电流(Ib):100nA;; Manufacturer: HGSEMI(华冠); Relevance: []; AddInBom: yes; ModelId: 23a59470b1e946e0afe388c2a9d3f488聨0819f05c4eef4c71ace90d822a990e87; ModelTransform: 192.913,236.22,0,0,0,0,0,0,0; Number of Channels: 双路; Vos - Input Offset Voltage: 1mV; Ib - Input Bias Current: 100nA; Voltage - Supply: ±16V；2V~32V; Quiescent Current per Amplifier: 600uA; Symbol: LM293AM/TR; Device: LM293AM/TR; Manufacturer Part: LM293ADR; LCSC Part Name: 双路开漏输出电压比较器; SupplierPart: C22461615; Supplier Footprint: SOP-8; JLCPCB Part Class: Extended Part; Datasheet: https://atta.szlcsc.com/upload/public/pdf/source/20240606/E2D352B189AFBE73CA0A08DC2990A498.pdf; Supplier: LCSC; ConvertToPcb: yes; FootprintName: SOIC-8_L4.9-W3.9-P1.27-LS6.2-BL; ModelName: SOIC-8_L4.9-W3.9-P1.27-LS6.2-BL; Common Mode Rejection Ratio(CMRR): -; Output Type: -; Operating Temperature: -40℃~+85℃